# EAGLE schematic PreDisV1.0 (EAGLE 8.6.1)
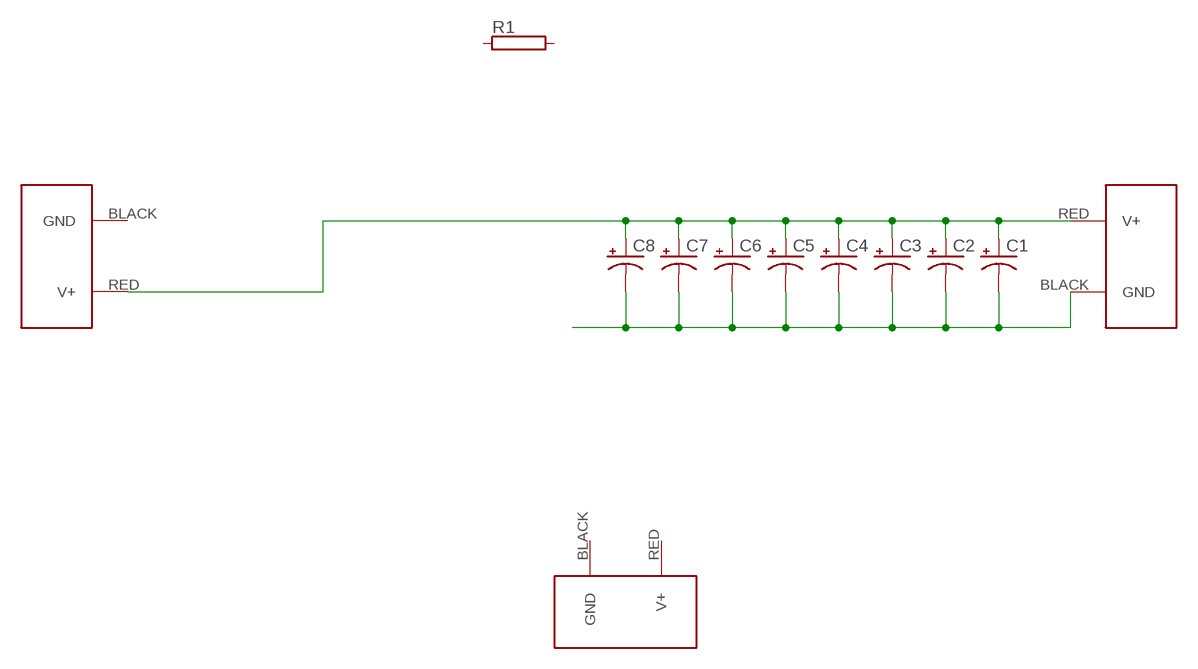
[diagram p0: schematic, sheet 1]

## Parts
C1  CPOL-USE3.5-8  [E3,5-8]
C2  CPOL-USE3.5-8  [E3,5-8]
C3  CPOL-USE3.5-8  [E3,5-8]
C4  CPOL-USE5-13  [E5-13]
C5  CPOL-USE5-13  [E5-13]
C6  CPOL-USE5-13  [E5-13]
C7  CPOL-USE5-13  [E5-13]
C8  CPOL-USE5-13  [E5-13]
J1  POWERPOLE_POWER45A_HORIZONTAL_DRILL  [POWERPOLE_PAIR_45A_HORIZ_HOLE]
J2  POWERPOLE_POWER45A_HORIZONTAL_DRILL  [POWERPOLE_PAIR_45A_HORIZ_HOLE]
J3  POWERPOLE_POWER45A_HORIZONTAL_DRILL  [POWERPOLE_PAIR_45A_HORIZ_HOLE]
R1  RMG100-H  [TO-247-2H]

## Nets
N$1: C1.+ C2.+ C3.+ C4.+ C5.+ C6.+ C7.+ C8.+ J1.RED(V+) J2.RED(V+)
N$2: C1.- C2.- C3.- C4.- C5.- C6.- C7.- C8.- J2.BLACK(GND)
Unconnected: R1.1 R1.2

## Power pins joined to a net without a drawn wire
GND: J1.BLACK(GND) J3.BLACK(GND)
V+: J3.RED(V+)

## Library data of the parts
C1-C8 = adafruit:CPOL-US: POLARIZED CAPACITOR, American symbol
J1-J3 = powerpoles:POWERPOLE_POWER: Anderson Powerpole Power Connector using ameteur radio standard layout
R1 = resistor-power:RMG100: TO-247 Power Resistor - RMG 100 Series Source: www.token.com.tw .. power-resistor-rmg100pdf; OC_FARNELL: unknown; OC_NEWARK: unknown